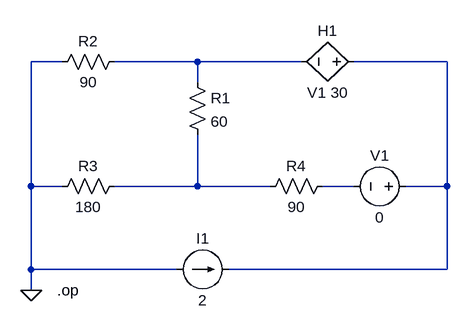
[diagram p0: schematic CH03-KP2-16.asc]
CH03-KP2-16.asc, the LTspice schematic file:
Version 4
SHEET 1 880 680
WIRE -32 192 -80 192
WIRE 176 192 48 192
WIRE 336 192 176 192
WIRE 560 192 416 192
WIRE 176 224 176 192
WIRE -80 384 -80 192
WIRE -32 384 -80 384
WIRE 176 384 176 304
WIRE 176 384 48 384
WIRE 288 384 176 384
WIRE 416 384 368 384
WIRE 560 384 560 192
WIRE 560 384 496 384
WIRE -80 512 -80 384
WIRE 144 512 -80 512
WIRE 560 512 560 384
WIRE 560 512 224 512
WIRE -80 544 -80 512
FLAG -80 544 0
DATAFLAG 176 192 "$"
DATAFLAG 560 384 "$"
DATAFLAG 176 384 "$"
SYMBOL res 160 208 R0
SYMATTR InstName R1
SYMATTR Value 60
SYMBOL res 64 176 R90
WINDOW 0 0 56 VBottom 2
WINDOW 3 32 56 VTop 2
SYMATTR InstName R2
SYMATTR Value 90
SYMBOL res 64 368 R90
WINDOW 0 0 56 VBottom 2
WINDOW 3 32 56 VTop 2
SYMATTR InstName R3
SYMATTR Value 180
SYMBOL res 384 368 R90
WINDOW 0 0 56 VBottom 2
WINDOW 3 32 56 VTop 2
SYMATTR InstName R4
SYMATTR Value 90
SYMBOL voltage 512 384 R90
WINDOW 0 -32 56 VBottom 2
WINDOW 3 32 56 VTop 2
SYMATTR InstName V1
SYMATTR Value 0
SYMBOL current 144 512 R270
WINDOW 0 32 40 VTop 2
WINDOW 3 -32 40 VBottom 2
SYMATTR InstName I1
SYMATTR Value 2
SYMBOL h 432 192 R90
WINDOW 0 -32 56 VBottom 2
WINDOW 3 32 56 VTop 2
SYMATTR InstName H1
SYMATTR Value V1 30
TEXT -40 544 Left 2 !.op

The netlist it stands for:
* CH03-KP2-16.asc
R1 N001 N003 60
R2 N001 0 90
R3 N003 0 180
R4 N004 N003 90
V1 N002 N004 0
I1 0 N002 2
H1 N002 N001 V1 30
.op
.backanno
.end